# EAGLE design main (EAGLE 9.5.1)
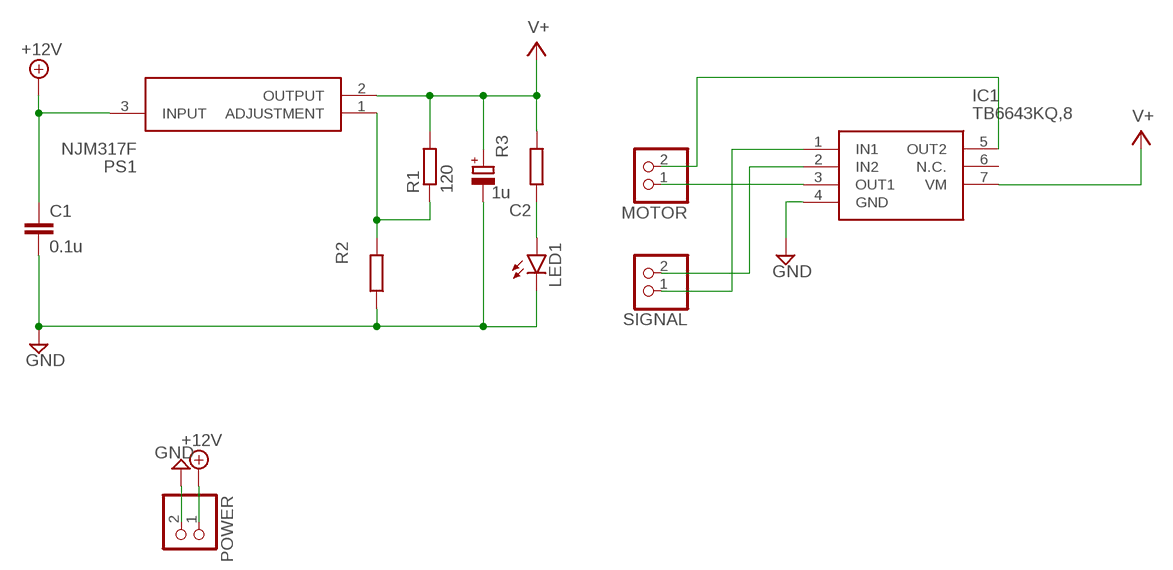
[diagram p0: schematic, sheet 1]

## Parts
C1  0.1u  C-EU050-024X044  [C050-024X044]
C2  1u  CPOL-EUE2.5-7  [E2,5-7]
IC1  TB6643KQ,8  [HSIP7-P-2.54A]
LED1  LED5MM  [LED5MM]
MOTOR  PINHD-1X2  [1X02]
POWER  PINHD-1X2  [1X02]
PS1  NJM317F  [TO254P500X1000X2170-3P]
R1  120  R-EU_0207/10  [0207/10]
R2  R-EU_0207/10  [0207/10]
R3  R-EU_0207/10  [0207/10]
SIGNAL  PINHD-1X2  [1X02]

## Nets
+12V: C1.1 POWER.1 PS1.3(INPUT)
GND: C1.2 C2.- IC1.4(GND) LED1.K(C) POWER.2 R2.1
N$1: IC1.3(OUT1) MOTOR.1
N$2: IC1.5(OUT2) MOTOR.2
N$3: PS1.1(ADJUSTMENT) R1.1 R2.2
N$4: IC1.2(IN2) SIGNAL.2
N$5: IC1.1(IN1) SIGNAL.1
N$6: LED1.A R3.1
V+: C2.+ IC1.7(VM) PS1.2(OUTPUT) R1.2 R3.2
Unconnected: IC1.6(N.C.)

## Library data of the parts
C1 = rcl:C-EU: CAPACITOR, European symbol; SPICEPREFIX: C
C2 = rcl:CPOL-EU: POLARIZED CAPACITOR, European symbol; SPICEPREFIX: C
IC1 = SamacSys_Parts:TB6643KQ,8: Bi-CMOS Integrated Circuit Silicon Monolithic Source: Datasheet <https://toshiba.semicon-storage.com/info/docget.jsp?did=11271&prodName=TB6643KQ>; DESCRIPTION: Bi-CMOS Integrated Circuit Silicon Monolithic; HEIGHT: mm; MANUFACTURER_NAME: Toshiba; MANUFACTURER_PART_NUMBER: TB6643KQ,8; MOUSER_PART_NUMBER: 757-TB6643KQ8; MOUSER_PRICE-STOCK: https://www.mouser.com/Search/Refine.aspx?Keyword=757-TB6643KQ8
LED1 = led:LED: LED OSRAM: - CHIPLED LG R971, LG N971, LY N971, LG Q971, LY Q971, LO R971, LY R971 LH N974, LH R974 LS Q976, LO Q976, LY Q976 LO Q996 - Hyper CHIPLED LW Q18S LB Q993, LB Q99A, LB R99A - SideLED LS A670, LO A670, LY A670, LG A670, LP A670 LB A673, LV A673, LT A673, LW A673 LH A674 LY A675 LS A676, LA A676, LO A676, LY A676, LW A676 LS A679, LY A679, LG A679 - Hyper Micro SIDELED® LS Y876, LA Y876, LO Y876, LY Y876 LT Y87S - SmartLED LW L88C, LW L88S LB L89C, LB L89S, LG L890 LS L89K, LO L89K, LY L89K LS L896, LA L896, LO L896, LY L896 - TOPLED LS T670, LO T670, LY T670, LG T670, LP T670 LSG T670, LSP T670, LSY T670, LOP T670, LYG T670 LG T671, LOG T671, LSG T671 LB T673, LV T673, LT T673, LW T673 LH T674 LS T676, LA T676, LO T676, LY T676, LB T676, LH T676, LSB T676, LW T676 LB T67C, LV T67C, LT T67C, LS T67K, LO T67K, LY T67K, LW E67C LS E67B, LA E67B, LO E67B, LY E67B, LB E67C, LV E67C, LT E67C LW T67C LS T679, LY T679, LG T679 LS T770, LO T770, LY T770, LG T770, LP T770 LB T773, LV T773, LT T773, LW T773 LH T774 LS E675, LA E675, LY E675, LS T675 LS T776, LA T776, LO T776, LY T776, LB T776 LHGB T686 LT T68C, LB T68C - Hyper Mini TOPLED® LB M676 - Mini TOPLED Santana® LG M470 LS M47K, LO M47K, LY M47K Source: http://www.osram.convergy.de LUXEON: - LUMILED® LXK2-PW12-R00, LXK2-PW12-S00, LXK2-PW14-U00, LXK2-PW14-V00 LXK2-PM12-R00, LXK2-PM12-S00, LXK2-PM14-U00 LXK2-PE12-Q00, LXK2-PE12-R00, LXK2-PE12-S00, LXK2-PE14-T00, LXK2-PE14-U00 LXK2-PB12-K00, LXK2-PB12-L00, LXK2-PB12-M00, LXK2-PB14-N00, LXK2-PB14-P00, LXK2-PB14-Q00 LXK2-PR12-L00, LXK2-PR12-M00, LXK2-PR14-Q00, LXK2-PR14-R00 LXK2-PD12-Q00, LXK2-PD12-R00, LXK2-PD12-S00 LXK2-PH12-R00, LXK2-PH12-S00 LXK2-PL12-P00, LXK2-PL12-Q00, LXK2-PL12-R00 Source: www.luxeon.com KINGBRIGHT: KA-3528ASYC Source: www.kingbright.com
MOTOR POWER SIGNAL = pinhead:PINHD-1X2: PIN HEADER
PS1 = SamacSys_Parts:NJM317F: Linear Voltage Regulators Adj 3-Terminal Source: Datasheet <https://www.njr.com/semicon/PDF/NJM317_E.pdf>; DESCRIPTION: Linear Voltage Regulators Adj 3-Terminal; HEIGHT: 5mm; MANUFACTURER_NAME: NJR; MANUFACTURER_PART_NUMBER: NJM317F; MOUSER_PART_NUMBER: 513-NJM317F; MOUSER_PRICE-STOCK: https://www.mouser.com/Search/Refine.aspx?Keyword=513-NJM317F
R1-R3 = rcl:R-EU_: RESISTOR, European symbol; SPICEPREFIX: R

## Board
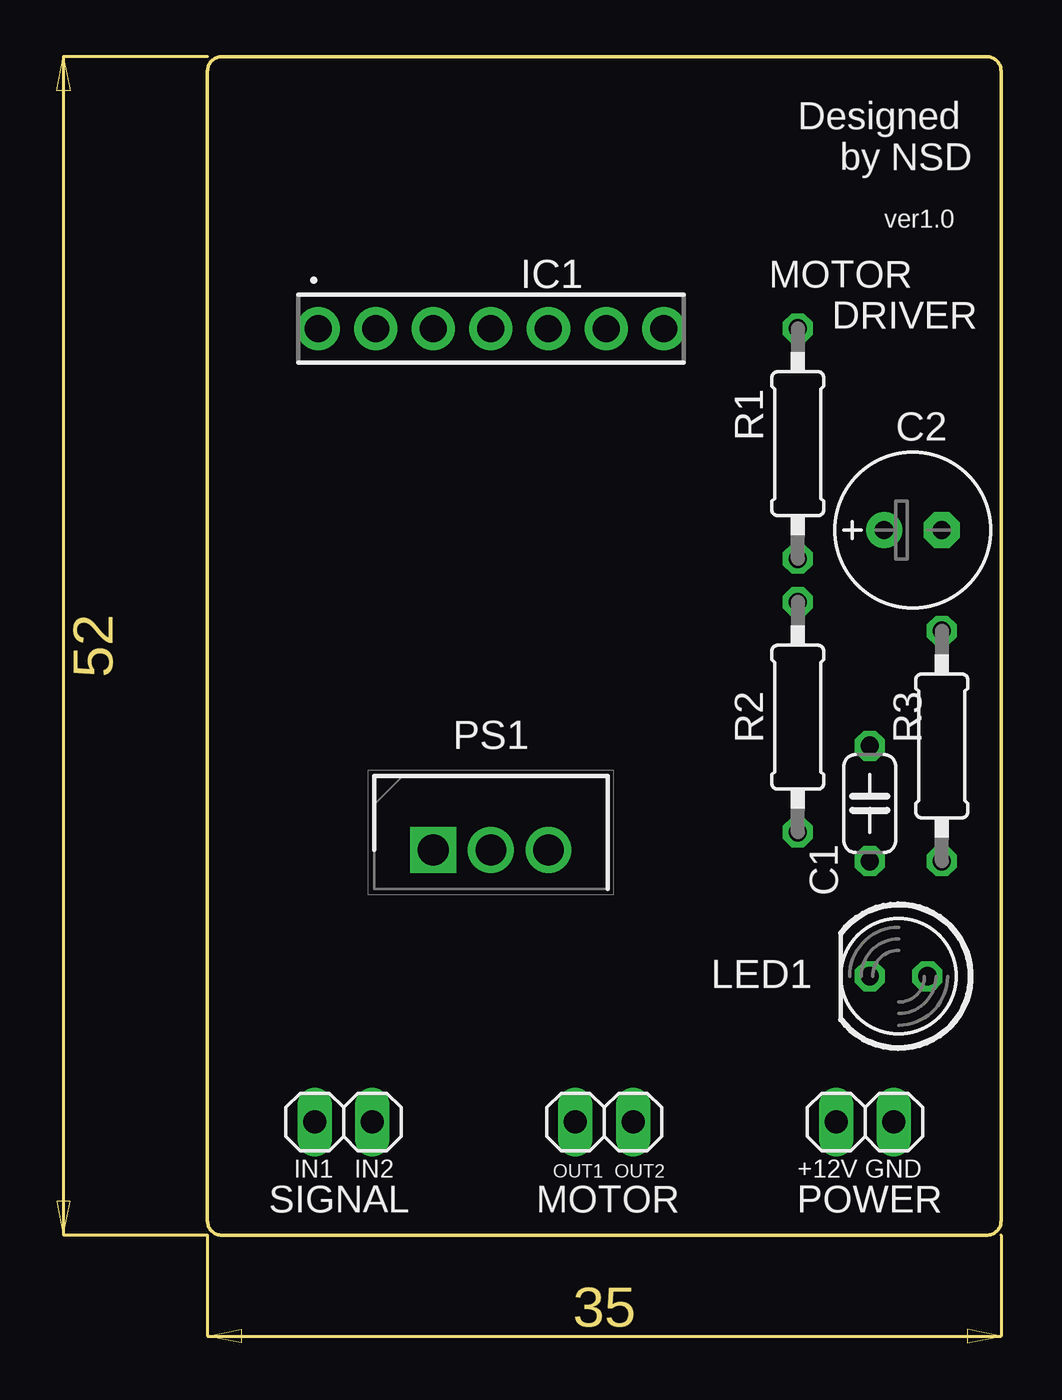
[diagram p1: board, top side]
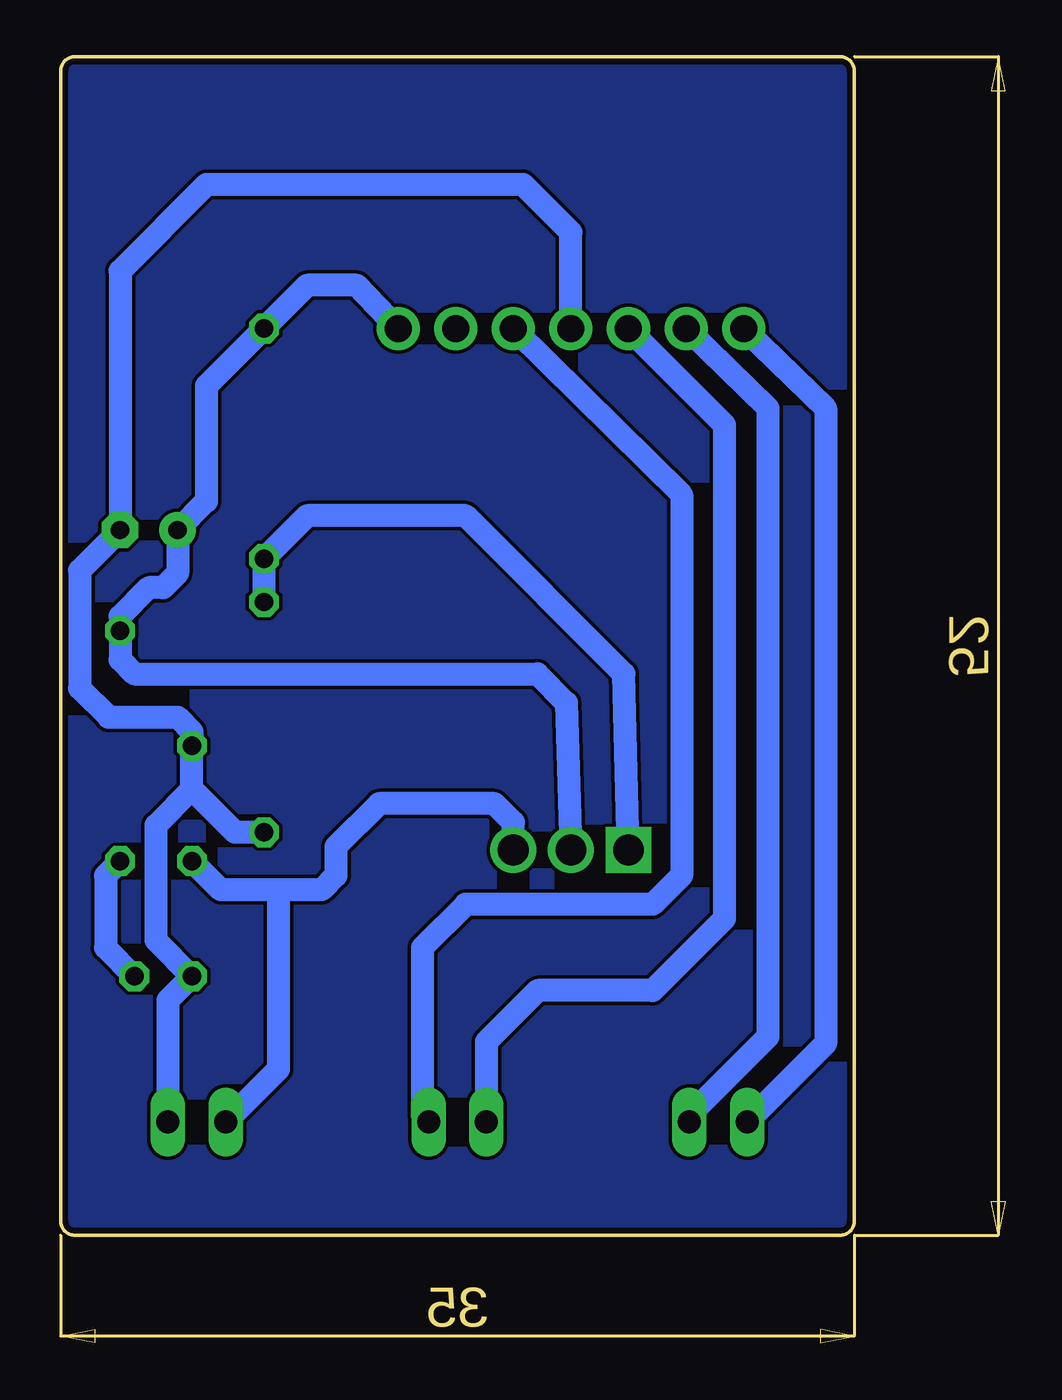
[diagram p2: board, bottom side, seen from below]

Size 35 x 52 mm. Coordinates in mm from the lower left corner, seen from the top.
Outline: 0,51.37 0,0.64 arc90 0.64,0 34.37,0 arc90 35,0.64 35,51.37 arc90 34.37,52 0.64,52 arc90 0,51.37
Copper layers (1*16): Top 0.035mm / dielectric 1.5mm / Bottom 0.035mm
Design rules "SeeedStudio_2layer_DRU_no_angle_20140221": minimum track width 6mil, minimum drill 12mil, track to track 6mil, track to pad 6mil, pad to pad 6mil, via to via 6mil, smd to smd 0mil, copper to edge 10mil, drill to drill 10mil, minimum pad ring 10mil, minimum via ring 6mil, stop-mask expansion 2mil, vias tented up to drill 100mil, thermal gap 10mil

### Footprints (pad centres in the part's own frame; a part is rotated, then mirrored left to right if it is on the bottom)
C050-024X044 = drill 0.813 octagon: 1 -2.54,0; 2 2.54,0
E2,5-7 = drill 0.813 pad 1.6: + -1.27,0 | drill 0.813 pad 1.6 octagon: - 1.27,0
HSIP7-P-2.54A = drill 1.19 pad 1.9: 1 -7.62,0; 2 -5.08,0; 3 -2.54,0; 4 0,0; 5 2.54,0; 6 5.08,0; 7 7.62,0
LED5MM = drill 0.813 octagon: A -1.27,0; K 1.27,0
1X02 = drill 1.016 long: 1 -1.27,0; 2 1.27,0
TO254P500X1000X2170-3P = drill 1.35 pad 2.025 square: 1 0,0 | drill 1.35 pad 2.025: 2 2.54,0; 3 5.08,0
0207/10 = drill 0.813 octagon: 1 -5.08,0; 2 5.08,0

### Placement (x,y rotation side)
C1  29.21,19.05 90 top
C2  31.11,31.11 0 top
IC1  12.5,40 0 top
LED1  30.48,11.43 180 top
MOTOR  17.5,5 0 top
POWER  29,5 0 top
PS1  9.96,17 0 top
R1  26.04,34.92 90 top
R2  26.04,22.86 90 top
R3  32.38,21.59 90 top
SIGNAL  6,5 0 top

### Tracks (layer width: path | path; a pad name or v marks a point on that pad's centre or on a via)
+12V
  Bottom 1.016: POWER.1 25.4,7.33 25.4,15.24 | 25.4,15.24 23.5,15.24 22.86,15.88 22.86,17.14 20.95,19.05 15.88,19.05 15.04,18.21 PS1.3 | 25.4,15.24 27.94,15.24 C1.1
GND
  Bottom 1.016: POWER.2 30.27,10.37 LED1.K 30.8,13.02 30.8,18.1 29.21,19.68 | IC1.4 12.5,44.25 14.61,46.35 28.57,46.35 32.38,42.55 C2.- 34.16,29.34 34.16,24.13 32.89,22.86 29.84,22.86 29.21,22.23 C1.2 29.21,19.68 | R2.1 27.3,17.78 29.21,19.68
N$1
  Bottom 1.016: MOTOR.1 16.23,8.54 13.97,10.79 8.89,10.79 5.71,13.97 5.71,35.76 IC1.3
N$2
  Bottom 1.016: MOTOR.2 19.05,5.28 19.05,12.7 17.14,14.61 8.89,14.61 7.62,15.88 7.62,32.67 IC1.5
N$3
  Bottom 1.016: R2.2 R1.1 24.13,31.75 17.14,31.75 10.16,24.77 PS1.1
N$4
  Bottom 1.016: SIGNAL.2 7.42,5.15 3.81,8.76 3.81,36.48 IC1.2
N$5
  Bottom 1.016: SIGNAL.1 1.27,8.46 1.27,36.48 IC1.1
N$6
  Bottom 1.016: LED1.A 33.02,12.7 33.02,15.88 R3.1
N$7
  pour Bottom: 0.64,51.44 0.64,0.64 34.29,0.64 34.29,51.44
V+
  Bottom 1.016: IC1.7 21.93,41.91 24.13,41.91 R1.2 28.57,37.47 28.57,32.38 C2.+ 29.84,29.21 30.48,28.57 31.11,28.57 32.38,27.3 R3.2 32.38,25.4 31.75,24.77 13.97,24.77 12.7,23.5 PS1.2

### Text on the board
tNames: Designed / by NSD | ver1.0 | MOTOR / DRIVER | IN1 IN2 | OUT1 OUT2 | +12V GND